# EasyEDA Pro project 音游小键盘.eprj

# Schematic Schematic1
Board Name: Board1; Create Date: 2024-05-16; Page Name: P1; Project Name: KeyBoard; Schematic Name: Schematic1; Update Date: 2024-06-21
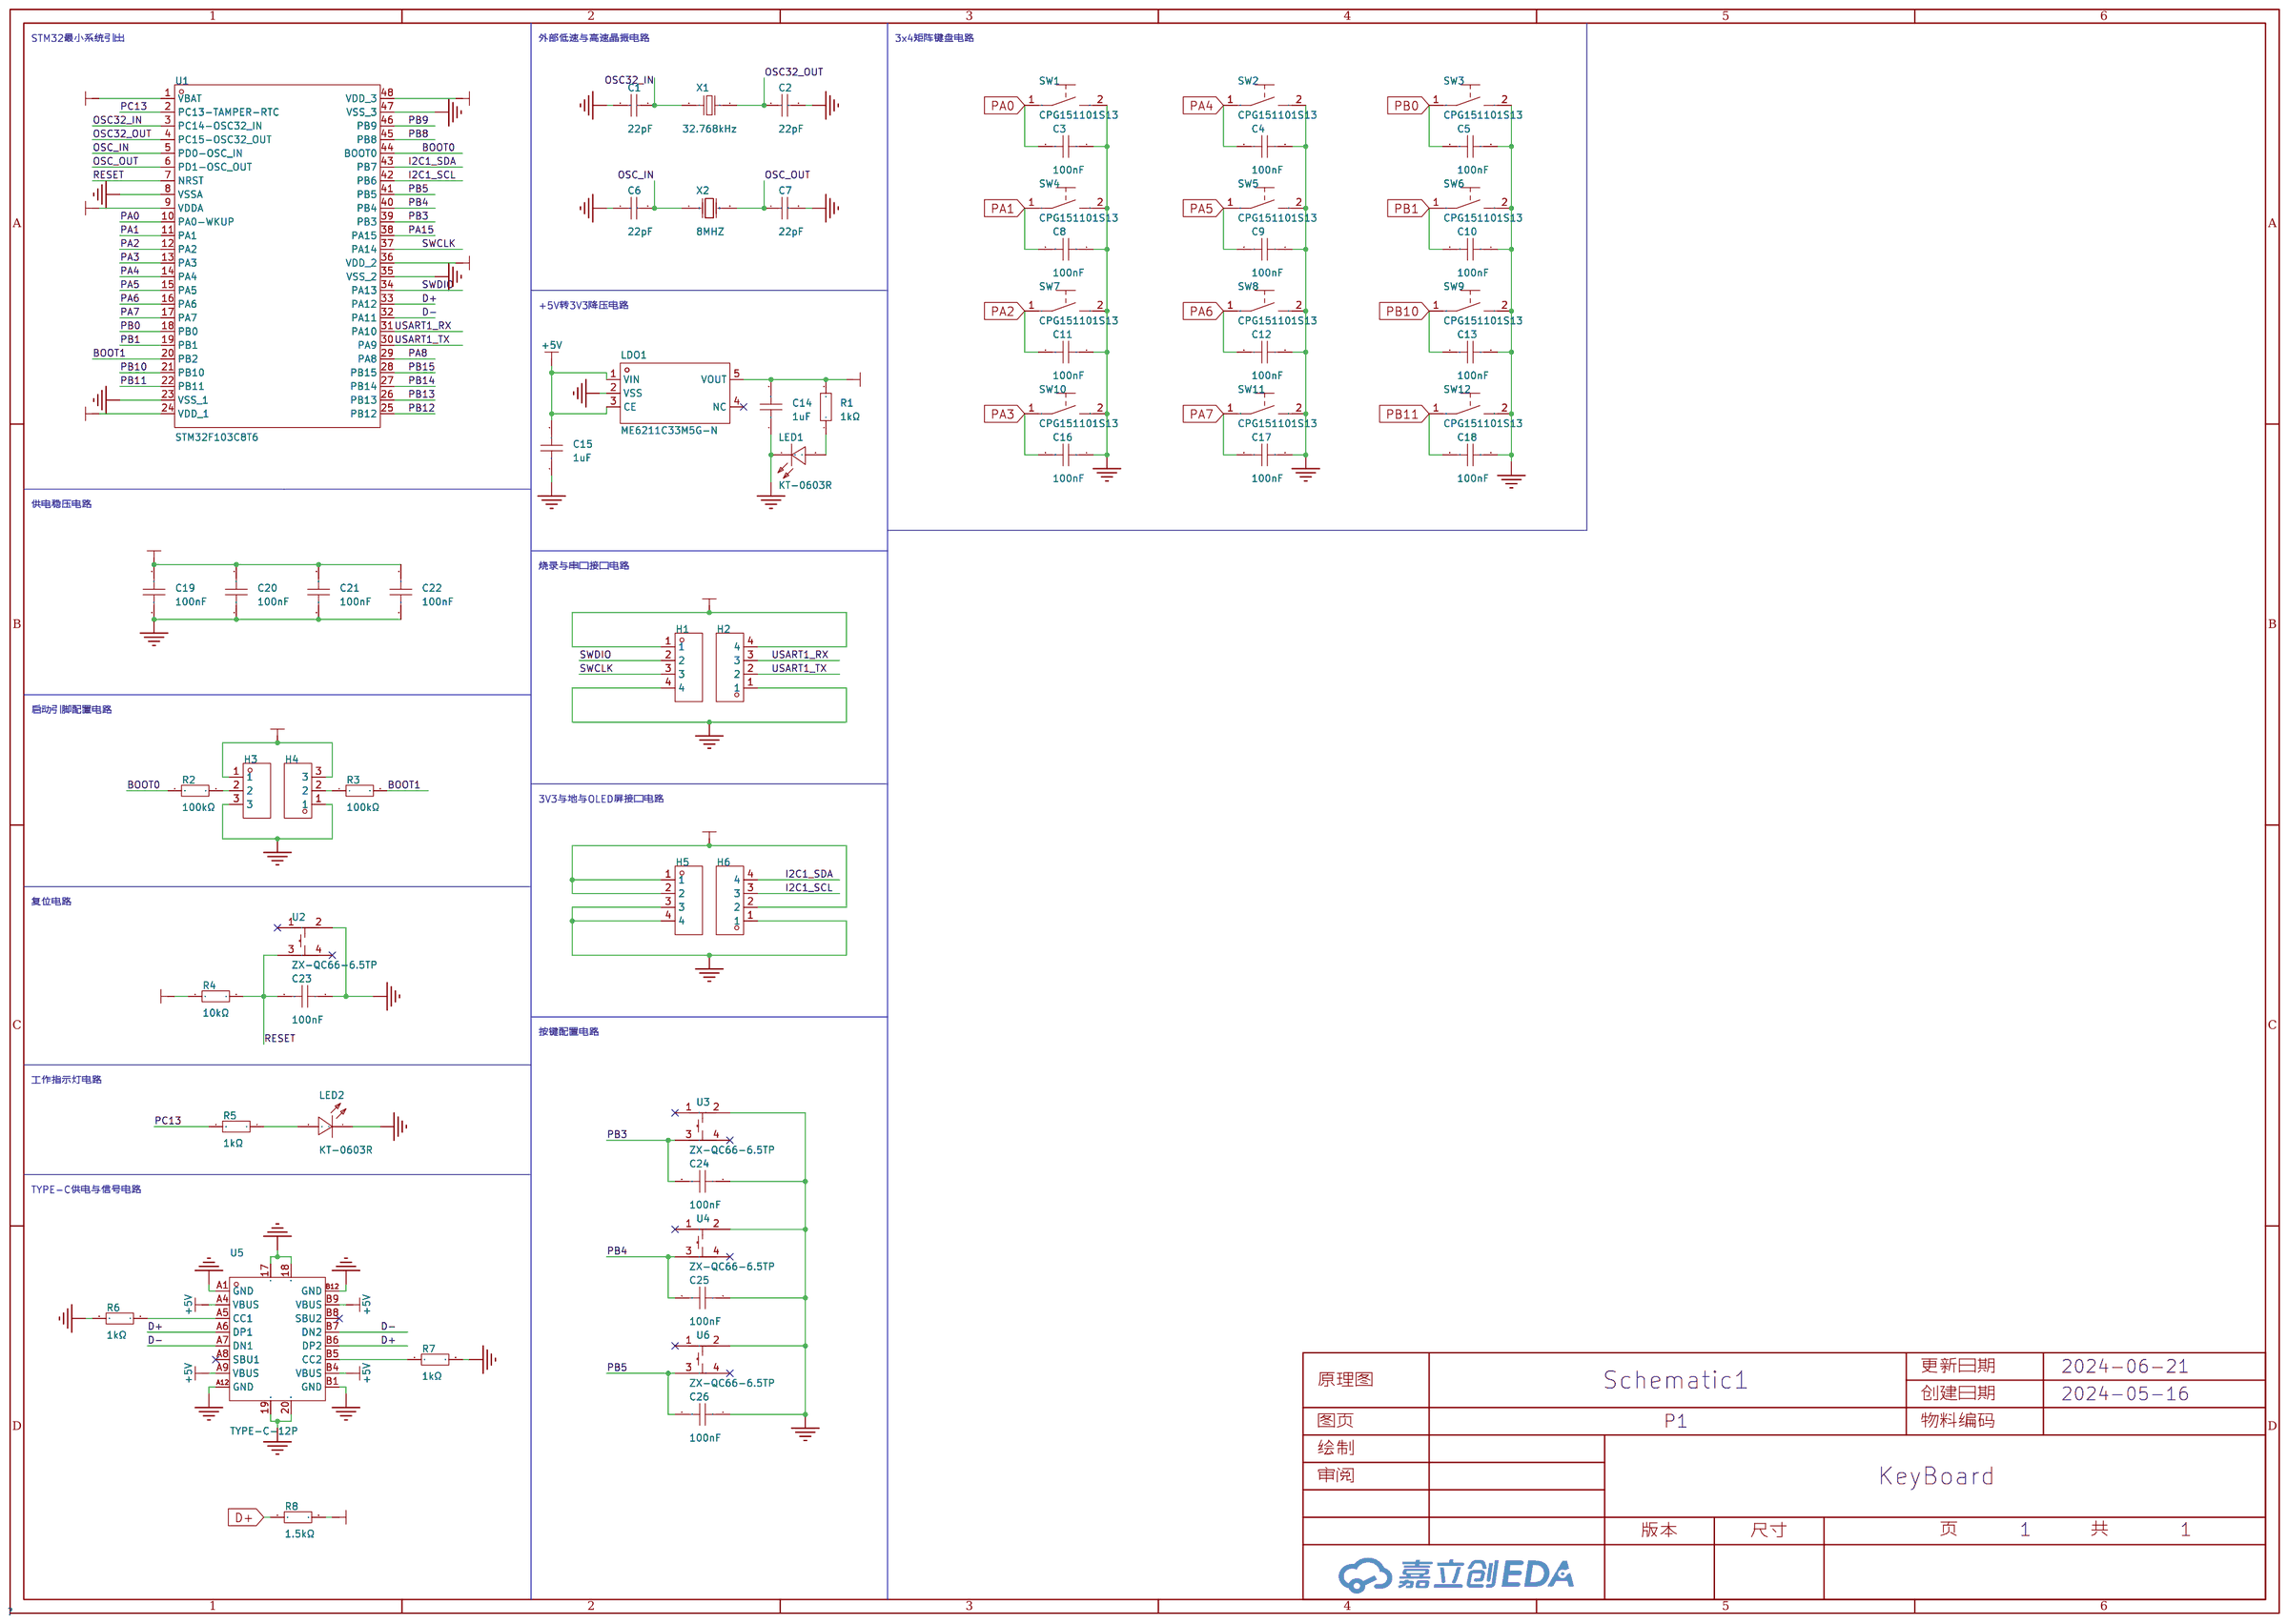
[diagram p0: schematic sheet]

## Parts
C1  22pF  [C0603]
C2  22pF  [C0603]
C3  100nF  [C0603]
C4  100nF  [C0603]
C5  100nF  [C0603]
C6  22pF  [C0603]
C7  22pF  [C0603]
C8  100nF  [C0603]
C9  100nF  [C0603]
C10  100nF  [C0603]
C11  100nF  [C0603]
C12  100nF  [C0603]
C13  100nF  [C0603]
C14  1uF  [C0603]
C15  1uF  [C0603]
C16  100nF  [C0603]
C17  100nF  [C0603]
C18  100nF  [C0603]
C19  100nF  [C0603]
C20  100nF  [C0603]
C21  100nF  [C0603]
C22  100nF  [C0603]
C23  100nF  [C0603]
C24  100nF  [C0603]
C25  100nF  [C0603]
C26  100nF  [C0603]
H1  -  [HDR-TH_4P-P2.54-V-F]
H2  -  [HDR-TH_4P-P2.54-V-F]
H3  -  [HDR-TH_3P-P2.54-V-F]
H4  -  [HDR-TH_3P-P2.54-V-F]
H5  -  [HDR-TH_4P-P2.54-V-F]
H6  -  [HDR-TH_4P-P2.54-V-F]
LDO1  ME6211C33M5G-N  [SOT-23-5_L3.0-W1.7-P0.95-LS2.8-BL]
LED1  KT-0603R  [LED0603-RD]
LED2  KT-0603R  [LED0603-RD]
R1  1kΩ  [R0603]
R2  100kΩ  [R0603]
R3  100kΩ  [R0603]
R4  10kΩ  [R0603]
R5  1kΩ  [R0603]
R6  1kΩ  [R0603]
R7  1kΩ  [R0603]
R8  1.5kΩ  [R0603]
SW1  CPG151101S13  [KEY-TH_CPG1511F01S0X]
SW2  CPG151101S13  [KEY-TH_CPG1511F01S0X]
SW3  CPG151101S13  [KEY-TH_CPG1511F01S0X]
SW4  CPG151101S13  [KEY-TH_CPG1511F01S0X]
SW5  CPG151101S13  [KEY-TH_CPG1511F01S0X]
SW6  CPG151101S13  [KEY-TH_CPG1511F01S0X]
SW7  CPG151101S13  [KEY-TH_CPG1511F01S0X]
SW8  CPG151101S13  [KEY-TH_CPG1511F01S0X]
SW9  CPG151101S13  [KEY-TH_CPG1511F01S0X]
SW10  CPG151101S13  [KEY-TH_CPG1511F01S0X]
SW11  CPG151101S13  [KEY-TH_CPG1511F01S0X]
SW12  CPG151101S13  [KEY-TH_CPG1511F01S0X]
U1  STM32F103C8T6  [LQFP-48_L7.0-W7.0-P0.50-LS9.0-BL]
U2  ZX-QC66-6.5TP  [KEY-SMD_4P-L6.0-W6.0-P4.50-LS8.6]
U3  ZX-QC66-6.5TP  [KEY-SMD_4P-L6.0-W6.0-P4.50-LS8.6]
U4  ZX-QC66-6.5TP  [KEY-SMD_4P-L6.0-W6.0-P4.50-LS8.6]
U5  TYPE-C-12P  [USB-SMD_TYPE-C16PIN]
U6  ZX-QC66-6.5TP  [KEY-SMD_4P-L6.0-W6.0-P4.50-LS8.6]
X1  32.768kHz  [CRYSTAL-SMD_L3.2-W1.5-1]
X2  8MHZ  [HC-49S_L11.5-W5.0-P4.88]

## Library data of the parts
C1 C2 C6 C7 = CL10C220JB8NNNC: 容值:22pF;精度:±5%;额定电压:50V;材质(温度系数):C0G;; LCSC Part Name: 22pF ±5% 50V; Supplier Part: C1653; Manufacturer: SAMSUNG(三星); Supplier Footprint: 0603; JLCPCB Part Class: 基础库; Datasheet: https://atta.szlcsc.com/upload/public/pdf/source/20160218/1457707763339.pdf; Supplier: LCSC; Tolerance: ±5%; Voltage Rated: 50V; Temperature Coefficient: C0G
C3-C5 C8-C13 C16-C26 = CC0603KRX7R9BB104: 容值:100nF;精度:±10%;额定电压:50V;材质(温度系数):X7R;; LCSC Part Name: 100nF ±10% 50V; Supplier Part: C14663; Manufacturer: YAGEO(国巨); Supplier Footprint: 0603; JLCPCB Part Class: 基础库; Datasheet: https://atta.szlcsc.com/upload/public/pdf/source/20180910/C282072_33301C7F631E79921B82A8DAC6BCC5B3.pdf; Supplier: LCSC; Tolerance: ±10%; Voltage Rated: 50V; Temperature Coefficient: X7R
C14 C15 = CL10A105KB8NNNC: 容值:1uF;精度:±10%;额定电压:50V;材质(温度系数):X5R;; LCSC Part Name: 1uF ±10% 50V; Supplier Part: C15849; Manufacturer: SAMSUNG(三星); Supplier Footprint: 0603; JLCPCB Part Class: 基础库; Datasheet: https://atta.szlcsc.com/upload/public/pdf/source/20160218/1457707763339.pdf; Supplier: LCSC; Tolerance: ±10%; Voltage Rated: 50V; Temperature Coefficient: X5R
H1 H2 H5 H6 = HDR-F_2.54_1x4P: Supplier Part: C2718488; Supplier Footprint: 插件; JLCPCB Part Class: 扩展库
H3 H4 = HDR-F_2.54_1x3P: Supplier Part: C541850; Supplier Footprint: 插件; JLCPCB Part Class: 扩展库
LDO1 = ME6211C33M5G-N: 输出类型:固定;最大输入电压:6V;输出电压:3.3V;最大输出电流:500mA;电源纹波抑制比(PSRR):70dB;输出极性:正极;; LCSC Part Name: 输入6V 输出3.3V 500mA; Supplier Part: C82942; Manufacturer: MICRONE(南京微盟); Supplier Footprint: SOT-23-5; JLCPCB Part Class: 扩展库; Datasheet: https://atta.szlcsc.com/upload/public/pdf/source/20170918/C82942_1505727073070976520.pdf; Supplier: LCSC; Output Type: 固定; Maximum Input Voltage: 6V; Output Voltage: 3.3V; MAX Output Current: 500mA; Power Supply Rejection Ratio (PSRR): 70dB; Dropout Voltage: 260mV@(200mA); Output Polarity: 正极; Number of Outputs: 1
LED1 LED2 = KT-0603R: 发光颜色:红色;功率:-;正向电流:-;主波长:-;二极管配置:-;透镜颜色:-;色温:-;发光角度:-;载带方式:-;工作温度:-40℃~+85℃;; LCSC Part Name: 0603 红灯 高亮; Supplier Part: C2286; Manufacturer: KENTO; Supplier Footprint: 0603; JLCPCB Part Class: 基础库; Datasheet: https://atta.szlcsc.com/upload/public/pdf/source/20160616/1466072038404.pdf; Supplier: LCSC; Emitted Color: 红色; Operating Temperature: -40℃~+85℃
R1 R5 = 0603WAF1001T5E: 电阻类型:厚膜电阻;阻值:1kΩ;精度:±1%;功率:100mW;最大工作电压:75V;温度系数:±100ppm/℃;; LCSC Part Name: 1kΩ ±1% 100mW 厚膜电阻; Supplier Part: C21190; Manufacturer: UNI-ROYAL(厚声); Supplier Footprint: 0603; JLCPCB Part Class: 基础库; Datasheet: https://atta.szlcsc.com/upload/public/pdf/source/20200306/C422600_1E6D84923E4A46A82E41ADD87F860B5C.pdf; Supplier: LCSC; Type: 厚膜电阻; Tolerance: ±1%; Power(Watts): 100mW; Overload Voltage (Max): 75V; Temperature Coefficient: ±100ppm/℃; Operating Temperature Range: -55℃~+155℃
R2 R3 = 0603WAF1003T5E: 电阻类型:厚膜电阻;阻值:100kΩ;精度:±1%;功率:100mW;最大工作电压:75V;温度系数:±100ppm/℃;; LCSC Part Name: 100kΩ ±1% 100mW 厚膜电阻; Supplier Part: C25803; Manufacturer: UNI-ROYAL(厚声); Supplier Footprint: 0603; JLCPCB Part Class: 基础库; Datasheet: https://atta.szlcsc.com/upload/public/pdf/source/20200306/C422600_1E6D84923E4A46A82E41ADD87F860B5C.pdf; Supplier: LCSC; Type: 厚膜电阻; Tolerance: ±1%; Power(Watts): 100mW; Overload Voltage (Max): 75V; Temperature Coefficient: ±100ppm/℃; Operating Temperature Range: -55℃~+155℃
R4 R6 R7 = 0603WAF1002T5E: 电阻类型:厚膜电阻;阻值:10kΩ;精度:±1%;功率:100mW;最大工作电压:75V;温度系数:±100ppm/℃;; LCSC Part Name: 厚膜电阻 10kΩ ±1% 100mW; Supplier Part: C25804; Manufacturer: UNI-ROYAL(厚声); Supplier Footprint: 0603; JLCPCB Part Class: 基础库; Datasheet: https://atta.szlcsc.com/upload/public/pdf/source/20200306/C422600_1E6D84923E4A46A82E41ADD87F860B5C.pdf; Supplier: LCSC; Type: 厚膜电阻; Tolerance: ±1%; Power(Watts): 100mW; Overload Voltage (Max): 75V; Temperature Coefficient: ±100ppm/℃; Operating Temperature Range: -55℃~+155℃
R8 = 0603WAF1501T5E: 电阻类型:厚膜电阻;阻值:1.5kΩ;精度:±1%;功率:100mW;最大工作电压:75V;温度系数:±100ppm/℃;; LCSC Part Name: 1.5kΩ ±1% 100mW 厚膜电阻; Supplier Part: C22843; Manufacturer: UNI-ROYAL(厚声); Supplier Footprint: 0603; JLCPCB Part Class: 基础库; Datasheet: https://atta.szlcsc.com/upload/public/pdf/source/20200306/C422600_1E6D84923E4A46A82E41ADD87F860B5C.pdf; Supplier: LCSC; Type: 厚膜电阻; Tolerance: ±1%; Power(Watts): 100mW; Overload Voltage (Max): 75V; Temperature Coefficient: ±100ppm/℃; Operating Temperature Range: -55℃~+155℃
SW1-SW12 = CPG151101S13: 轴类型:青轴;工作电压:2V~12V;针脚数:2;操作力:50gf@±10gf;; LCSC Part Name: KT 青轴; Supplier Part: C404353; Manufacturer: Kailh(凯华); Supplier Footprint: 插件; JLCPCB Part Class: 扩展库; Datasheet: https://atta.szlcsc.com/upload/public/pdf/source/20190830/C404353_03D773C25064FB6981E6251E455188E4.pdf; Supplier: LCSC; Axis Type: 青轴; Operating Voltage: 2V~12V; Pin: 2; Mechanical Life: 7000万次; Operation Force: 50gf@±10gf; Conduction Travel: 1.9mm; Total Travel: 4mm; Operating Temperature: -10℃~+70℃
U1 = STM32F103C8T6: CPU内核:ARM-M3;程序存储容量:64KB;RAM总容量:20KB;GPIO端口数量:37;工作电压范围:2V~3.6V;CPU最大主频:72MHz;程序存储器类型:FLASH;; Supplier Part: C8734; Manufacturer: ST(意法半导体); Supplier Footprint: LQFP-48(7x7); JLCPCB Part Class: 扩展库; Datasheet: https://atta.szlcsc.com/upload/public/pdf/source/20220812/8363ACEC51AD55ECEB84799464F7CB85.pdf; Supplier: LCSC; CPU Core: ARM-M3; Program Storage Size: 64KB; RAM Size: 20KB; GPIO Ports Number: 37; Operating Voltage Range: 2V~3.6V; CPU Maximum Speed: 72MHz; Program Memory Type: FLASH; Operating Temperature Range: -40℃~+85℃; ADC (Bit): 12bit; Universal Serial Bus: 有; Peripheral/Function: 看门狗；DMA；看门狗；温度传感器; Watchdog: 有; Infrared Data Association: 有; Low-Voltage Detect: 有; Direct Memory Access: 有; Internal Oscillator: 有
U2-U4 U6 = ZX-QC66-6.5TP: 电路结构:单刀单掷;按钮形状:圆形按钮;作用力:260gf;安装方式:立贴;开关长度:6mm;开关宽度:6mm;开关高度:6.5mm;带支架:不带;触点电流:50mA;额定电压(AC):250V;额定电压(DC):12V;绝缘电阻:100MΩ;机械寿命:10万次;; LCSC Part Name: 6*6*6.5贴片; Supplier Part: C7470155; Manufacturer: Megastar(兆星); Supplier Footprint: SMD; JLCPCB Part Class: 扩展库; Datasheet: https://atta.szlcsc.com/upload/public/pdf/source/20230724/B428FC16196F325371E46D1CDDE28AA5.pdf; Supplier: LCSC; Circuit: 单刀单掷; Actuator Style: 圆形按钮; Operating Force: 260gf; Mounting Style: 立贴; Switch Length: 6mm; Switch Width: 6mm; Switch Height: 6.5mm; Strike Gundam: 不带; Contact Current: 50mA; Voltage Rating (AC): 250V; Voltage Rating (DC): 12V; Insulation Resistance: 100MΩ; Actuator/Cap Color: 黑色; Pin Style: 鸥翼型; Mechanical Life: 10万次; Operating Temperature: -30℃~+80℃
U5 = TYPE-C-12P: Supplier Part: C9900014866; Supplier Footprint: USB_TypeC; JLCPCB Part Class: 扩展库; Supplier: LCSC
X1 = FC31M2-32.768-NTLLLDT: 晶振类型:贴片晶振;频率:32.768kHz;常温频差:±20ppm;外接负载电容:12.5pF;频率稳定度(全温):±20ppm;; LCSC Part Name: 32.768kHz ±20ppm 12.5pF; Supplier Part: C2842180; Manufacturer: HCI(杭晶); Supplier Footprint: SMD3215-2P; JLCPCB Part Class: 扩展库; Datasheet: https://atta.szlcsc.com/upload/public/pdf/source/20220525/2E044CF849361D91E29045F083201687.pdf; Supplier: LCSC; Crystal Type: 贴片晶振; Normal temperature Frequency Tolerance: ±20ppm; External load capacitor: 12.5pF; Frequency Stability(Full temperature range): ±20ppm; Equivalent Series Resistance (ESR): 50kΩ; Operating Temperature: -40℃~+85℃
X2 = 8MHZ: Supplier Part: C9900021358; Supplier Footprint: X-HC49U直插; JLCPCB Part Class: 扩展库; Supplier: LCSC

## Nets
3V3: C14.2 C19.2 C20.2 C21.2 C22.2 H1.1 H2.4 H3.1 H4.3 H5.1 H5.2 H6.2 LDO1.5(VOUT) R1.2 R4.2 R8.2 U1.1(VBAT) U1.9(VDDA) U1.24(VDD_1) U1.36(VDD_2) U1.48(VDD_3)
+5V: C15.2 LDO1.1(VIN) LDO1.3(CE) U5.A4(VBUS) U5.A9(VBUS) U5.B4(VBUS) U5.B9(VBUS)
GND: C1.1 C2.1 C3.1 C4.1 C5.1 C6.1 C7.2 C8.1 C9.1 C10.1 C11.1 C12.1 C13.1 C14.1 C15.1 C16.1 C17.1 C18.1 C19.1 C20.1 C21.1 C22.1 C23.1 C24.1 C25.1 C26.1 H1.4 H2.1 H3.3 H4.1 H5.3 H5.4 H6.1 LDO1.2(VSS) LED1.1(K) LED2.1(K) R6.2 R7.2 SW1.2 SW2.2 SW3.2 SW4.2 SW5.2 SW6.2 SW7.2 SW8.2 SW9.2 SW10.2 SW11.2 SW12.2 U1.8(VSSA) U1.23(VSS_1) U1.35(VSS_2) U1.47(VSS_3) U2.2 U3.2 U4.2 U5.17 U5.18 U5.19 U5.20 U5.A1(GND) U5.A12(GND) U5.B1(GND) U5.B12(GND) U6.2
BOOT0: R2.1 U1.44(BOOT0)
BOOT1: R3.2 U1.20(PB2)
D+: R8.1 U1.33(PA12) U5.A6(DP1) U5.B6(DP2)
D-: U1.32(PA11) U5.A7(DN1) U5.B7(DN2)
I2C1_SCL: H6.3 U1.42(PB6)
I2C1_SDA: H6.4 U1.43(PB7)
OSC32_IN: C1.2 U1.3(PC14-OSC32_IN) X1.2
OSC32_OUT: C2.2 U1.4(PC15-OSC32_OUT) X1.1
OSC_IN: C6.2 U1.5(PD0-OSC_IN) X2.1(OSC1)
OSC_OUT: C7.1 U1.6(PD1-OSC_OUT) X2.2(OSC2)
PA0: C3.2 SW1.1 U1.10(PA0-WKUP)
PA1: C8.2 SW4.1 U1.11(PA1)
PA2: C11.2 SW7.1 U1.12(PA2)
PA3: C16.2 SW10.1 U1.13(PA3)
PA4: C4.2 SW2.1 U1.14(PA4)
PA5: C9.2 SW5.1 U1.15(PA5)
PA6: C12.2 SW8.1 U1.16(PA6)
PA7: C17.2 SW11.1 U1.17(PA7)
PA8: U1.29(PA8)
PA15: U1.38(PA15)
PB0: C5.2 SW3.1 U1.18(PB0)
PB1: C10.2 SW6.1 U1.19(PB1)
PB3: C24.2 U1.39(PB3) U3.3
PB4: C25.2 U1.40(PB4) U4.3
PB5: C26.2 U1.41(PB5) U6.3
PB8: U1.45(PB8)
PB9: U1.46(PB9)
PB10: C13.2 SW9.1 U1.21(PB10)
PB11: C18.2 SW12.1 U1.22(PB11)
PB12: U1.25(PB12)
PB13: U1.26(PB13)
PB14: U1.27(PB14)
PB15: U1.28(PB15)
PC13: R5.2 U1.2(PC13-TAMPER-RTC)
RESET: C23.2 R4.1 U1.7(NRST) U2.3
SWCLK: H1.3 U1.37(PA14)
SWDIO: H1.2 U1.34(PA13)
USART1_RX: H2.3 U1.31(PA10)
USART1_TX: H2.2 U1.30(PA9)
$1N2502: LED2.2(A) R5.1
$1N8138: H3.2 R2.2
$1N8141: H4.2 R3.1
$1N12765: LED1.2(A) R1.1
$1N28341: R6.1 U5.A5(CC1)
$1N28394: R7.1 U5.B5(CC2)

Not connected (* = marked no-connect by the designer): LDO1 4(NC)*; U2 1* 4*; U3 1* 4*; U4 1* 4*; U5 A8(SBU1)* B8(SBU2)*; U6 1* 4*

## Notes on the sheet
- STM32最小系统引出
- 外部低速与高速晶振电路
- 3x4矩阵键盘电路
- +5V转3V3降压电路
- 供电稳压电路
- 烧录与串口接口电路
- 启动引脚配置电路
- 3V3与地与OLED屏接口电路
- 复位电路
- 按键配置电路
- 工作指示灯电路
- TYPE-C供电与信号电路

# Board PCB1
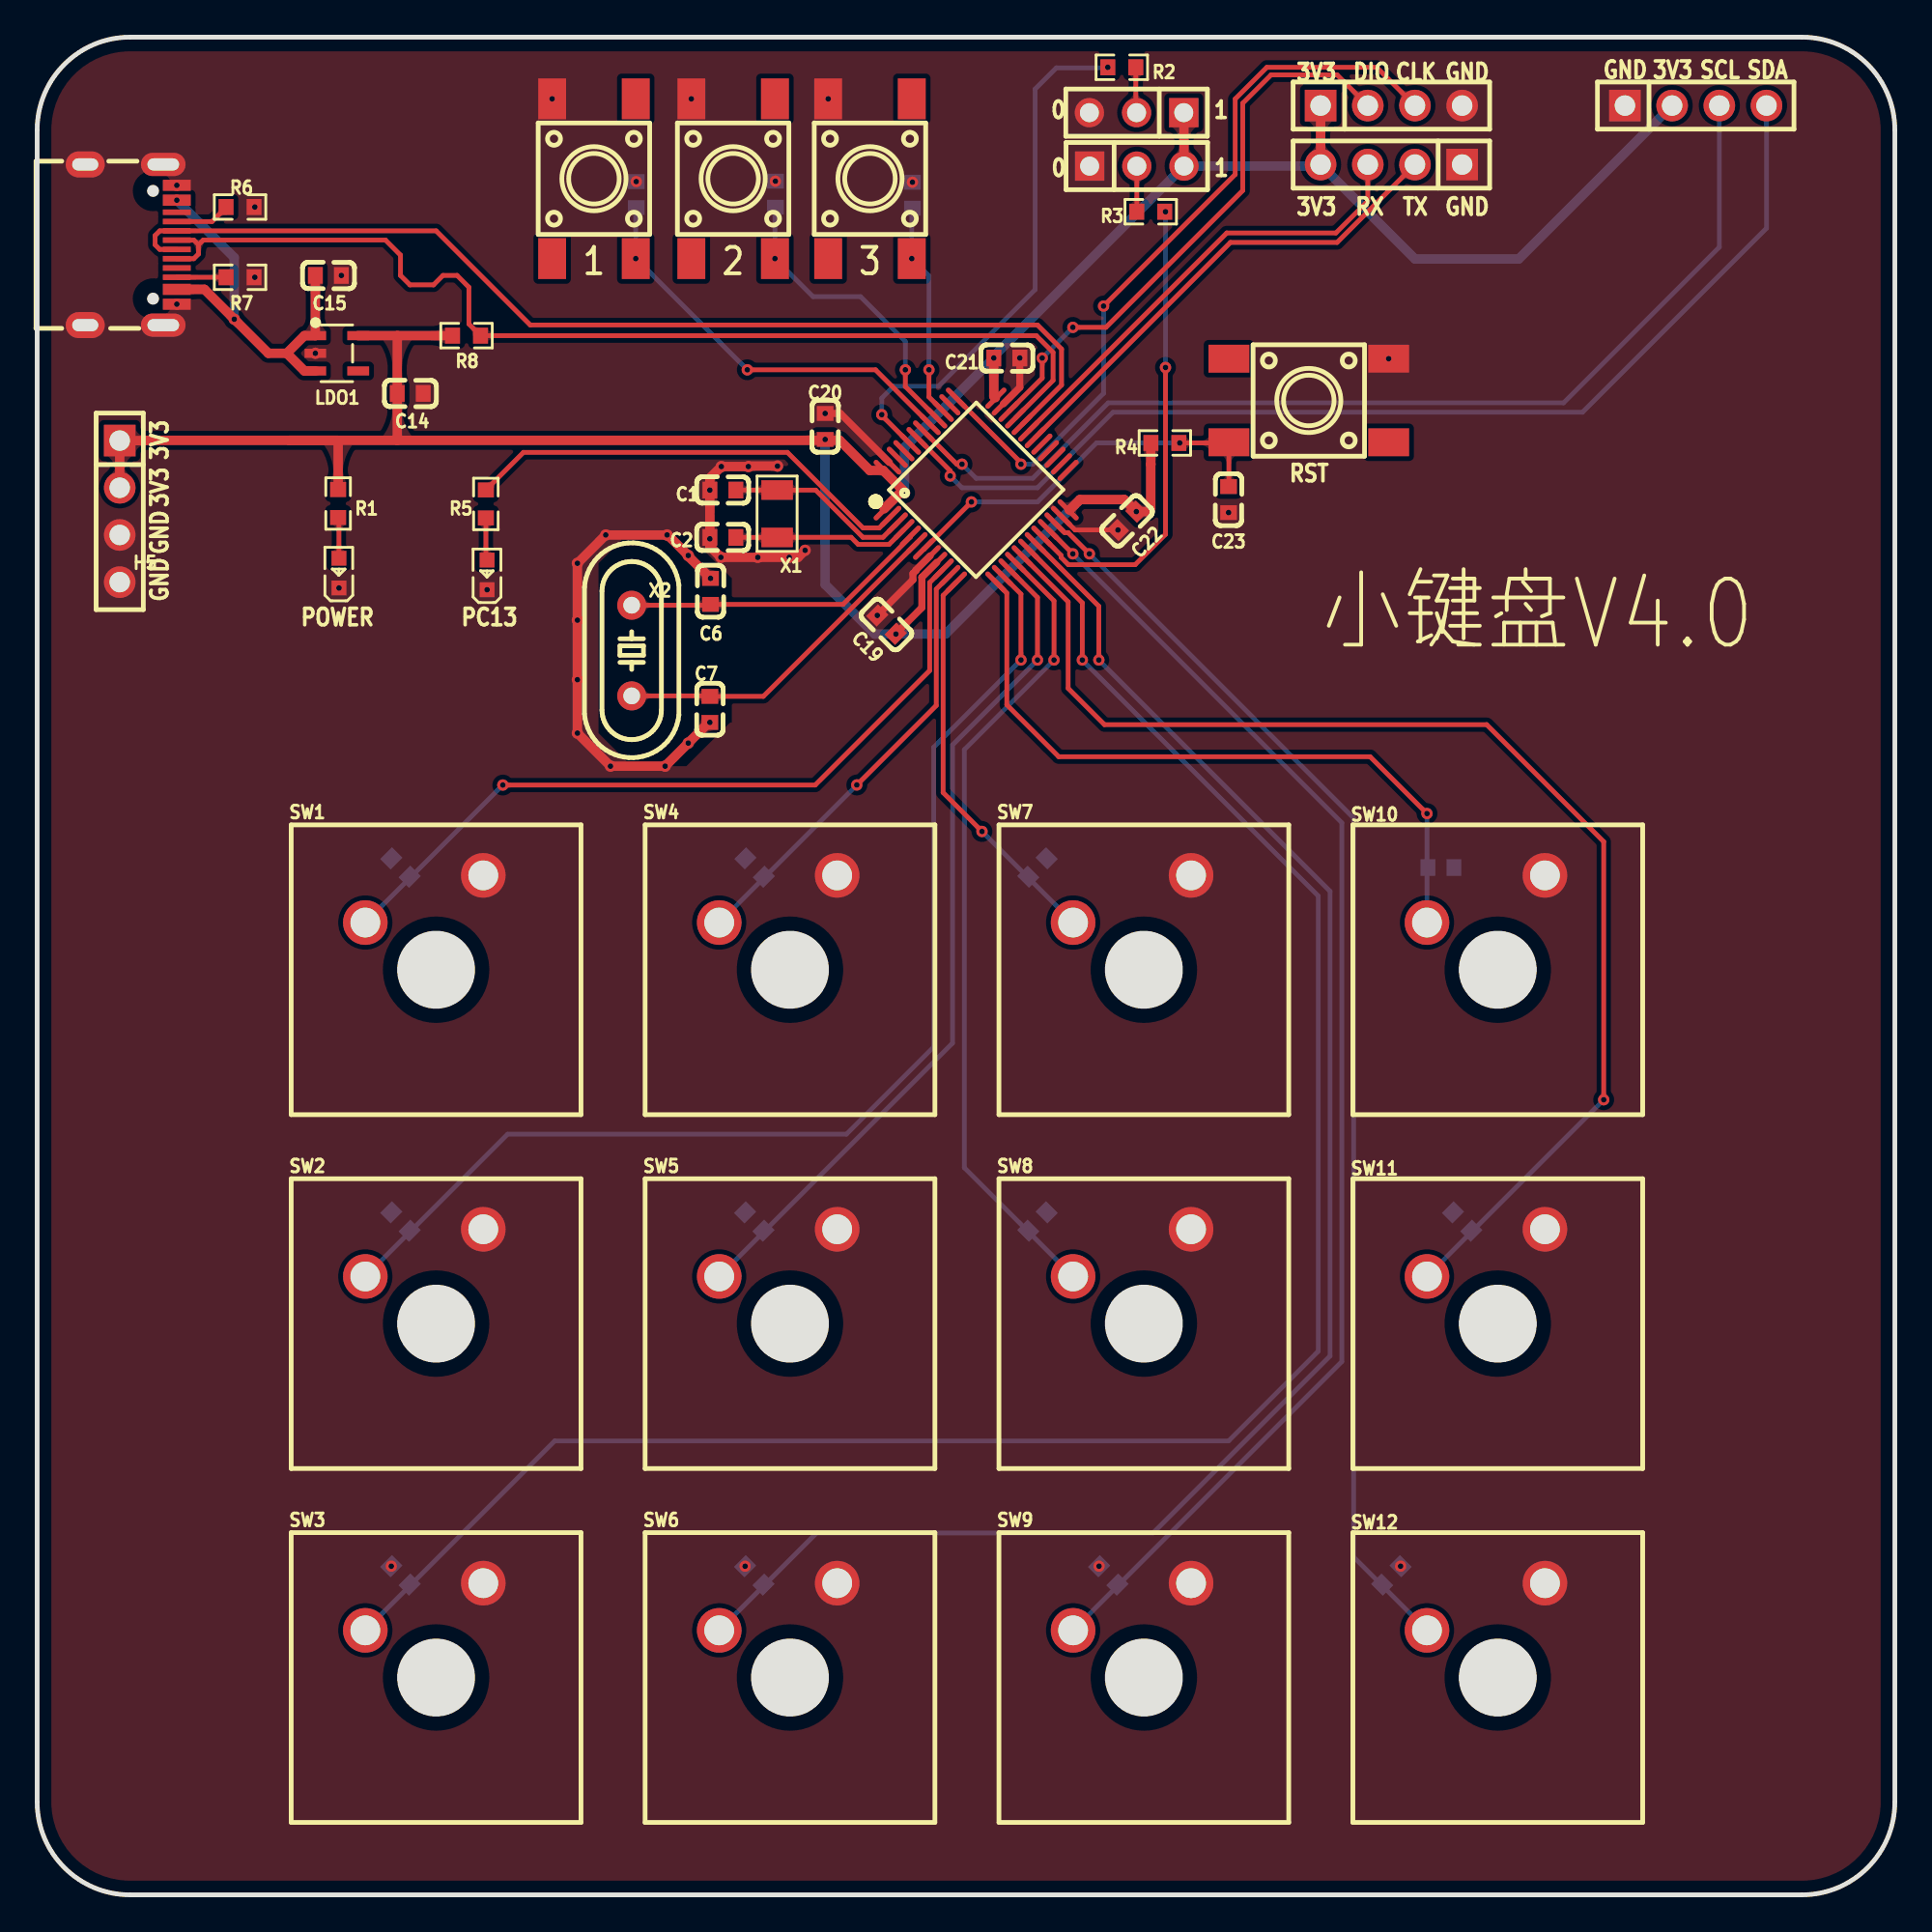
[diagram p1: board, top side]
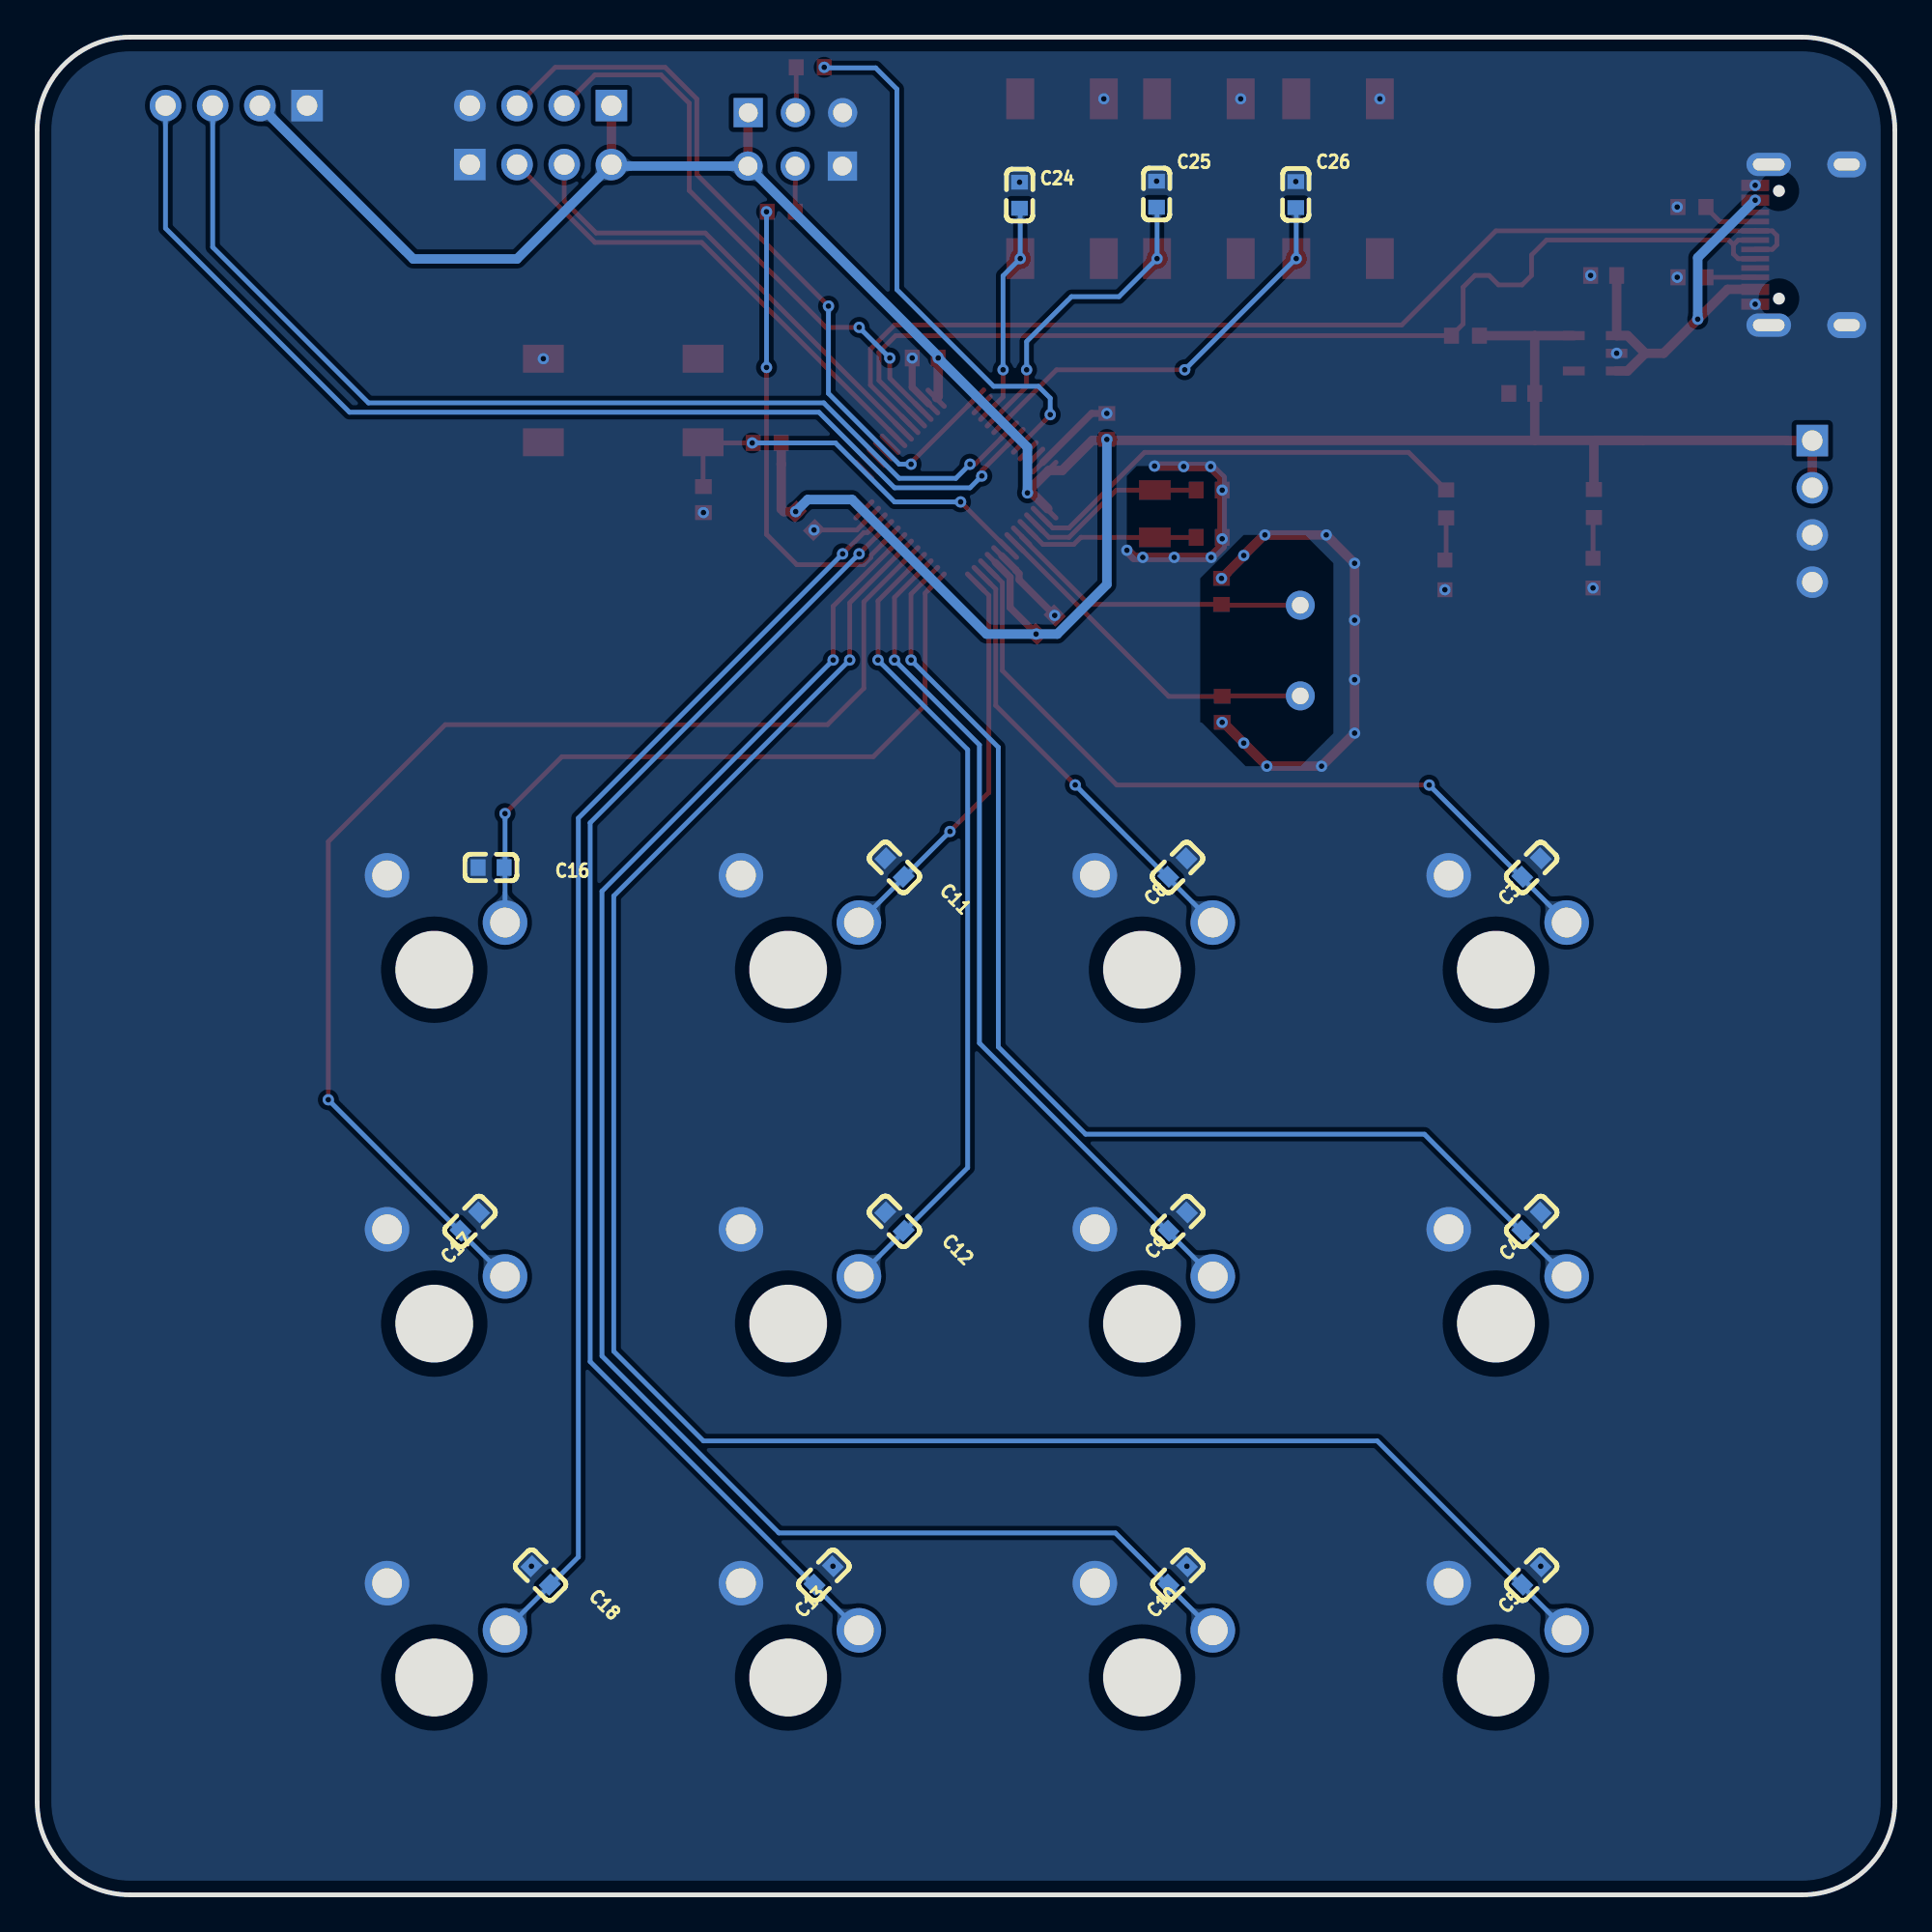
[diagram p2: board, bottom side, seen from below]

Outline 100 x 100 mm; copper layers: Top Layer, Bottom Layer. Coordinates in mm from the lower left corner of the outline.
Outline path: 0,95 0,5 arc(1.46,1.46) 5,0 95,0 arc(98.54,1.46) 100,5 100,95 arc(98.54,98.54) 95,100 5,100 arc(1.46,98.54) 0,95
Stack: Top Layer 0.035mm / Dielectric1 1.51mm FR4 er 4.5 / Bottom Layer 0.035mm

## Design rules (mm)
net D-: DP1
net D+: DP1
template: 自定义配置
spacing copperThickness1oz (default): track to track 0.102, other pairs 0.152 to 0.3
spacing copperThickness2oz: track to track 0.203, other pairs 0.152 to 0.3
track width copperThickness1oz (default): min 0.127, default 0.254, max 2.54
track width copperThickness2oz: min 0.203, default 0.254, max 2.54
track width Power: min 0.127, default 0.508, max 2.54
differential pair differentialPair (default): width min 0.127, default 0.254, max 2.54; gap min 0.152, default 0.152
via viaSize (default): diameter min 0.5, default 0.61, max 10; hole min 0.3, default 0.305, max 6.299
net GND uses Power
net 3V3 uses Power
net +5V uses Power

## Placement (name value [footprint] x y rotation side)
C1  22pF  [C0603]  36.91 75.62 0 top
C2  22pF  [C0603]  36.91 73.07 0 top
C3  100nF  [C0603]  19.56 55.3 315 bottom
C4  100nF  [C0603]  19.56 36.25 315 bottom
C5  100nF  [C0603]  19.56 17.2 315 bottom
C6  22pF  [C0603]  36.25 70.17 270 top
C7  22pF  [C0603]  36.21 63.81 270 top
C8  100nF  [C0603]  38.62 55.3 315 bottom
C9  100nF  [C0603]  38.6 36.25 315 bottom
C10  100nF  [C0603]  38.6 17.2 315 bottom
C11  100nF  [C0603]  53.85 55.3 225 bottom
C12  100nF  [C0603]  53.85 36.25 225 bottom
C13  100nF  [C0603]  57.66 17.2 315 bottom
C14  1uF  [C0603]  20.08 80.82 180 top
C15  1uF  [C0603]  15.68 87.17 180 top
C16  100nF  [C0603]  75.56 55.3 180 bottom
C17  100nF  [C0603]  76.71 36.25 315 bottom
C18  100nF  [C0603]  72.9 17.2 225 bottom
C19  100nF  [C0603]  45.72 68.38 315 top
C20  100nF  [C0603]  42.42 79.05 270 top
C21  100nF  [C0603]  52.2 82.73 180 top
C22  100nF  [C0603]  58.67 73.97 45 top
C23  100nF  [C0603]  64.13 75.11 90 top
C24  100nF  [C0603]  47.12 91.49 270 bottom
C25  100nF  [C0603]  39.74 91.55 270 bottom
C26  100nF  [C0603]  32.25 91.53 270 bottom
H1  -  [HDR-TH_4P-P2.54-V-F]  72.9 96.32 0 top
H2  -  [HDR-TH_4P-P2.54-V-F]  72.9 93.14 180 top
H3  -  [HDR-TH_3P-P2.54-V-F]  59.18 95.94 180 top
H4  -  [HDR-TH_3P-P2.54-V-F]  59.19 93.06 0 top
H5  -  [HDR-TH_4P-P2.54-V-F]  4.44 74.47 270 top
H6  -  [HDR-TH_4P-P2.54-V-F]  89.28 96.32 0 top
LDO1  ME6211C33M5G-N  [SOT-23-5_L3.0-W1.7-P0.95-LS2.8-BL]  16.13 82.98 270 top
LED1  KT-0603R  [LED0603-RD]  16.24 71.15 90 top
LED2  KT-0603R  [LED0603-RD]  24.22 71.05 90 top
R1  1kΩ  [R0603]  16.2 74.89 90 top
R2  100kΩ  [R0603]  58.39 98.38 0 top
R3  100kΩ  [R0603]  59.94 90.6 0 top
R4  10kΩ  [R0603]  60.71 78.16 180 top
R5  1kΩ  [R0603]  24.15 74.87 90 top
R6  1kΩ  [R0603]  10.92 90.86 0 top
R7  1kΩ  [R0603]  10.92 87.07 0 top
R8  1.5kΩ  [R0603]  23.11 83.93 180 top
SW1  CPG151101S13  [KEY-TH_CPG1511F01S0X]  20.84 53.61 0 top
SW2  CPG151101S13  [KEY-TH_CPG1511F01S0X]  20.84 34.56 0 top
SW3  CPG151101S13  [KEY-TH_CPG1511F01S0X]  20.84 15.51 0 top
SW4  CPG151101S13  [KEY-TH_CPG1511F01S0X]  39.89 53.61 0 top
SW5  CPG151101S13  [KEY-TH_CPG1511F01S0X]  39.89 34.56 0 top
SW6  CPG151101S13  [KEY-TH_CPG1511F01S0X]  39.89 15.51 0 top
SW7  CPG151101S13  [KEY-TH_CPG1511F01S0X]  58.94 53.61 0 top
SW8  CPG151101S13  [KEY-TH_CPG1511F01S0X]  58.94 34.56 0 top
SW9  CPG151101S13  [KEY-TH_CPG1511F01S0X]  58.94 15.51 0 top
SW10  CPG151101S13  [KEY-TH_CPG1511F01S0X]  77.99 53.61 0 top
SW11  CPG151101S13  [KEY-TH_CPG1511F01S0X]  77.99 34.56 0 top
SW12  CPG151101S13  [KEY-TH_CPG1511F01S0X]  77.99 15.51 0 top
U1  STM32F103C8T6  [LQFP-48_L7.0-W7.0-P0.50-LS9.0-BL]  50.55 75.62 315 top
U2  ZX-QC66-6.5TP  [KEY-SMD_4P-L6.0-W6.0-P4.50-LS8.6]  68.45 80.44 0 top
U3  ZX-QC66-6.5TP  [KEY-SMD_4P-L6.0-W6.0-P4.50-LS8.6]  44.83 92.38 90 top
U4  ZX-QC66-6.5TP  [KEY-SMD_4P-L6.0-W6.0-P4.50-LS8.6]  37.47 92.38 90 top
U5  TYPE-C-12P  [USB-SMD_TYPE-C16PIN]  4.95 88.82 270 top
U6  ZX-QC66-6.5TP  [KEY-SMD_4P-L6.0-W6.0-P4.50-LS8.6]  29.97 92.38 90 top
X1  32.768kHz  [CRYSTAL-SMD_L3.2-W1.5-1]  39.83 74.35 90 top
X2  8MHZ  [HC-49S_L11.5-W5.0-P4.88]  32 66.98 270 top

## Footprints (pads in the part's own frame, mm; a bottom-side part is the same pattern mirrored in y, then rotated)
C0603
  rect 0.8x0.9 smd: 1(-0.7,0) 2(0.7,0)
CRYSTAL-SMD_L3.2-W1.5-1
  rect 1.05x1.7 smd: 1(-1.275,0) 2(1.275,0)
HC-49S_L11.5-W5.0-P4.88
  round 1.56 hole 0.9: 1(-2.44,0) 2(2.44,0)
HDR-TH_3P-P2.54-V-F
  rect 1.575x1.575 hole 1.02: 1(-2.54,0)
  round 1.575 hole 1.02: 2(0,0) 3(2.54,0)
HDR-TH_4P-P2.54-V-F
  rect 1.7x1.7 hole 1.1: 1(-3.81,0)
  round 1.7 hole 1.1: 2(-1.27,0) 3(1.27,0) 4(3.81,0)
KEY-SMD_4P-L6.0-W6.0-P4.50-LS8.6
  rect 2.2x1.5 smd: 1(-4.3,2.25) 2(4.3,2.25) 3(-4.3,-2.25) 4(4.3,-2.25)
KEY-TH_CPG1511F01S0X
  round 2.4 hole 1.6: 1(-3.175,-1.27) 2(3.175,1.27)
LED0603-RD
  rect 0.8x0.8 smd: 1(-0.799,0) 2(0.799,0)
LQFP-48_L7.0-W7.0-P0.50-LS9.0-BL
  oval 0.27x1.5 smd: 1(-2.75,-4.25) 2(-2.25,-4.25) 3(-1.75,-4.25) 4(-1.25,-4.25) 5(-0.75,-4.25) 6(-0.25,-4.25) 7(0.25,-4.25) 8(0.75,-4.25) 9(1.25,-4.25) 10(1.75,-4.25) 11(2.25,-4.25) 12(2.75,-4.25) 25(2.75,4.25) 26(2.25,4.25) 27(1.75,4.25) 28(1.25,4.25) 29(0.75,4.25) 30(0.25,4.25) 31(-0.25,4.25) 32(-0.75,4.25) 33(-1.25,4.25) 34(-1.75,4.25) 35(-2.25,4.25) 36(-2.75,4.25)
  oval 1.5x0.27 smd: 13(4.25,-2.75) 14(4.25,-2.25) 15(4.25,-1.75) 16(4.25,-1.25) 17(4.25,-0.75) 18(4.25,-0.25) 19(4.25,0.25) 20(4.25,0.75) 21(4.25,1.25) 22(4.25,1.75) 23(4.25,2.25) 24(4.25,2.75) 37(-4.25,2.75) 38(-4.25,2.25) 39(-4.25,1.75) 40(-4.25,1.25) 41(-4.25,0.75) 42(-4.25,0.25) 43(-4.25,-0.25) 44(-4.25,-0.75) 45(-4.25,-1.25) 46(-4.25,-1.75) 47(-4.25,-2.25) 48(-4.25,-2.75)
R0603
  rect 0.806x0.864 smd: 1(-0.753,0) 2(0.753,0)
SOT-23-5_L3.0-W1.7-P0.95-LS2.8-BL
  rect 0.49x1.157 smd: 1(-0.95,-1.153) 2(0,-1.153) 3(0.95,-1.153)
  rect 0.49x1.175 smd: 4(0.95,1.153) 5(-0.95,1.153)
USB-SMD_TYPE-C16PIN
  oval 1.25x2.4 hole 0.65x1.7: 17(-4.325,1.835) 18(4.325,1.835)
  oval 1.4x2.1 hole 0.65x1.4: 19(-4.325,-2.365) 20(4.325,-2.365)
  rect 0.6x1.5 smd: A1(-3.2,2.565) A4(-2.4,2.565) A9(2.4,2.565) A12(3.2,2.565)
  rect 0.3x1.5 smd: A5(-1.25,2.565) A6(-0.25,2.565) A7(0.25,2.565) A8(1.25,2.565) B5(1.75,2.565) B6(0.75,2.565) B7(-0.75,2.565) B8(-1.75,2.565)

## Nets
As in the schematic, except:
+5V: C15.2 LDO1.1 LDO1.3 U5.A4 U5.A9
GND: C1.1 C2.1 C3.1 C4.1 C5.1 C6.1 C7.2 C8.1 C9.1 C10.1 C11.1 C12.1 C13.1 C14.1 C15.1 C16.1 C17.1 C18.1 C19.1 C20.1 C21.1 C22.1 C23.1 C24.1 C25.1 C26.1 H1.4 H2.1 H3.3 H4.1 H5.3 H5.4 H6.1 LDO1.2 LED1.1 LED2.1 R6.2 R7.2 SW1.2 SW2.2 SW3.2 SW4.2 SW5.2 SW6.2 SW7.2 SW8.2 SW9.2 SW10.2 SW11.2 SW12.2 U1.8 U1.23 U1.35 U1.47 U2.2 U3.2 U4.2 U5.17 U5.18 U5.19 U5.20 U5.A1 U5.A12 U6.2

Pads without a net: LDO1 4; U2 1 4; U3 1 4; U4 1 4; U5 A8 B8; U6 1 4

## Via types
v1: diameter 0.61, hole 0.305, Top Layer to Bottom Layer, 82 vias

## Routing (per net, layer and track width the routed paths; a pad name or vN(x,y) marks a point on that pad's centre or on a via; arc(x,y) is an arc through that point)
3V3: length 169.3
  Top Layer w0.381: 46.22,67.88 47.62,69.29 47.62,70.93 48.42,71.73
  Top Layer w0.508: LDO1.5 19.38,83.93 ; 19.38,83.93 R8.2 ; 19.38,83.93 19.38,78.3 ; 55.55,74.56 55.58,74.56 56.13,75.11 58.52,75.11 v1(59.17,74.46) 59.8,74.46 59.94,74.6 59.94,77 ; R1.2 16.2,78.3 13.55,78.3 ; H5.2 H5.1 5.8,78.28 5.82,78.3 13.55,78.3 ; H3.1 61.73,95.92 H4.3 ; 51.58,80.59 51.5,80.68 v1(51.5,82.73) ; 59.94,77 59.95,77.01 ; 59.94,77 59.94,78.15 R4.2 ; 19.38,78.3 13.55,78.3 ; 19.38,78.3 43.2,78.3 44.82,76.68 45.54,76.68 46.6,75.62 45.6,74.61 ; H1.1 H2.4
  Bottom Layer w0.508: v1(42.42,78.34) 42.42,70.54 45.09,67.87 v1(46.23,67.87) 48.9,67.87 56.13,75.11 58.52,75.11 v1(59.17,74.46) ; H6.2 79.76,88.06 74.17,88.06 H2.4 69,93.06 H4.3 51.5,82.82 v1(51.5,82.73) 46.69,77.92 v1(46.69,75.47)
+5V: length 22.1
  Top Layer w0.508: C15.2 LDO1.1 14.39,83.93 13.44,82.98 ; LDO1.3 14.39,82.03 13.44,82.98 ; U5.A9 9,86.42 v1(10.61,84.82) 12.45,82.98 13.44,82.98
  Bottom Layer w0.508: v1(7.52,91.22) 10.61,88.13 v1(10.61,84.82)
GND: length 55
  Top Layer w0.254: v1(58.18,73.47) 55.87,73.47 U1.23
  Top Layer w0.381: v1(42.42,79.75) 43.24,79.75 45.87,77.11 ; U1.8 47.31,71.32 47.31,71.3 47.14,71.13 47.14,70.79 v1(45.22,68.87) ; 52.01,80.26 52.9,81.15 v1(52.9,82.73)
  Top Layer w0.508: v1(36.25,70.87) 35.05,72.06 v1(35.05,72.1) 33.94,73.2 v1(33.91,73.2) v1(30.61,73.2) v1(29.08,71.68) v1(29.08,68.62) v1(29.08,65.41) v1(29.08,62.53) v1(30.86,60.76) v1(33.81,60.76) v1(35.05,62) 36.16,63.11 v1(36.21,63.11) ; v1(39.85,76.91) 38.31,76.91 v1(38.28,76.89) v1(36.83,76.89) 36.21,76.27 v1(36.21,75.62) v1(36.21,73) 36.21,72.59 v1(36.81,72) v1(38.79,72) v1(40.49,72) 40.96,72 v1(41.34,72.38)
  vias: v1(7.52,92.02) v1(7.52,85.62) v1(11.72,90.86) v1(11.72,87.07) v1(14.98,82.98) v1(16.25,70.35) v1(16.38,87.17) v1(19.06,17.69) v1(24.22,70.25) v1(27.72,96.68) v1(32.25,92.23) v1(35.22,96.68) v1(38.11,17.69) v1(39.74,92.25) v1(42.58,96.68) v1(47.12,92.19) v1(57.16,17.69) v1(64.13,74.41) v1(72.75,82.69) v1(73.39,17.69)
BOOT0: length 29
  Top Layer w0.254: 47.01,78.09 45.47,79.64 v1(45.47,79.68)
  Bottom Layer w0.254: v1(57.63,98.38) 57.6,98.35 54.86,98.35 53.72,97.21 53.72,86.41 48.51,81.2 46.1,81.2 45.47,80.57 v1(45.47,79.68)
BOOT1: length 25.4
  Top Layer w0.254: v1(60.74,82.22) 60.74,73.24 59.11,71.6 55.51,71.6 55.12,72 55.12,72.1 54.08,73.14
  Bottom Layer w0.254: v1(60.74,90.6) v1(60.74,82.22)
D+: length 58.2
  Top Layer w0.254: 8.69,88.82 8.94,89.08 18.75,89.08 19.56,88.27 19.56,87.17 20.07,86.67 21.34,86.67 21.84,87.17 22.61,87.17 23.24,86.54 23.24,84.56 R8.1 53.79,83.93 54.69,83.03 54.69,81.52 52.67,79.5 ; 8.69,88.82 8.69,88.33 8.43,88.07 U5.B6 ; 8.69,88.82 8.44,89.07 U5.A6
D-: length 58.2
  Top Layer w0.254: U5.A7 6.6,88.57 6.35,88.82 6.35,89.32 6.6,89.57 U5.B7 21.47,89.57 26.54,84.51 53.85,84.51 55.14,83.21 55.14,81.27 U1.32
I2C1_SCL: length 56.7
  Top Layer w0.254: U1.42 49.5,77.01 v1(49.78,77.01)
  Bottom Layer w0.254: H6.3 90.55,88.7 82.17,80.31 57.66,80.31 53.59,76.25 50.55,76.25 v1(49.78,77.01)
I2C1_SDA: length 59.4
  Top Layer w0.254: v1(49.15,76.38) 49.15,76.66 U1.43
  Bottom Layer w0.254: v1(49.15,76.38) 49.78,75.74 53.85,75.74 57.91,79.81 83.19,79.81 93.09,89.71 H6.4
OSC32_IN: length 10.1
  Top Layer w0.254: C1.2 39.83,75.62 39.83,75.62 41.91,75.62 44.45,73.08 45.53,73.08 U1.3
OSC32_OUT: length 9.5
  Top Layer w0.254: C2.2 X1.1 39.84,73.08 43.81,73.08 44.2,72.69 45.86,72.69 U1.4
OSC_IN: length 16.6
  Top Layer w0.254: X2.1 36.2,69.42 C6.2 43.38,69.47 47.01,73.1 47.01,73.14
OSC_OUT: length 18.8
  Top Layer w0.254: X2.2 36.19,64.54 C7.1 39.09,64.51 U1.6
PA0: length 41.8
  Top Layer w0.254: U1.10 48.04,70.64 48.04,65.9 41.88,59.74 v1(25.07,59.74)
  Bottom Layer w0.254: v1(25.07,59.74) SW1.1
PA1: length 23.8
  Top Layer w0.254: v1(44.12,59.75) 48.4,64.02 48.4,70.29 U1.11
  Bottom Layer w0.254: v1(44.12,59.75) 36.72,52.34
PA2: length 21.5
  Top Layer w0.254: v1(50.86,57.24) 48.77,59.34 48.77,69.95 U1.12
  Bottom Layer w0.254: v1(50.86,57.24) SW7.1
PA3: length 37.8
  Top Layer w0.254: U1.13 52.2,70.08 52.2,64.06 54.99,61.27 71.75,61.27 v1(74.81,58.2)
  Bottom Layer w0.254: v1(74.81,58.2) SW10.1
PA4: length 63.4
  Top Layer w0.254: v1(52.96,66.47) 52.96,70.02 U1.14
  Bottom Layer w0.254: v1(52.96,66.47) 48.26,61.77 48.26,45.64 43.56,40.94 25.32,40.94 SW2.1
PA5: length 45.8
  Top Layer w0.254: v1(53.85,66.47) 53.85,69.84 U1.15
  Bottom Layer w0.254: 36.72,33.29 49.28,45.85 49.28,61.9 v1(53.85,66.47)
PA6: length 43.7
  Top Layer w0.254: v1(54.74,66.47) 54.74,69.66 52.67,71.73
  Bottom Layer w0.254: v1(54.74,66.47) 49.91,61.65 49.91,39.14 SW8.1
PA7: length 67.8
  Top Layer w0.254: U1.17 55.5,69.6 55.5,64.95 57.46,62.99 78.03,62.99 84.33,56.69 v1(84.33,42.8)
  Bottom Layer w0.254: v1(84.33,42.8) SW11.1
PB0: length 107.1
  Top Layer w0.254: v1(56.26,66.47) 56.26,69.55 U1.18
  Bottom Layer w0.254: SW3.1 27.86,24.44 64.13,24.44 68.96,29.26 68.96,53.77 v1(56.26,66.47)
PB1: length 89.4
  Top Layer w0.254: U1.19 57.15,69.37 v1(57.15,66.47)
  Bottom Layer w0.254: v1(57.15,66.47) 69.6,54.03 69.6,29.01 60.07,19.48 41.96,19.48 36.72,14.24
PB3: length 11.7
  Top Layer w0.254: U1.39 48.01,80.63 v1(48.01,82.09)
  Bottom Layer w0.254: v1(48.01,82.09) 48.01,87.16 v1(47.08,88.08) 47.08,90.75 C24.2
PB4: length 16.5
  Top Layer w0.254: 48.42,79.5 46.74,81.19 v1(46.74,82.09)
  Bottom Layer w0.254: C25.2 39.72,90.82 v1(39.72,88.08) 41.76,86.03 44.32,86.03 46.74,83.62 v1(46.74,82.09)
PB5: length 22.3
  Top Layer w0.254: v1(38.23,82.09) 45.13,82.09 U1.41
  Bottom Layer w0.254: v1(38.23,82.09) 32.24,88.08 v1(32.22,88.08) 32.22,90.8 C26.2
PB10: length 71.8
  Top Layer w0.254: U1.21 54.45,73.49 v1(55.75,72.19)
  Bottom Layer w0.254: v1(55.75,72.19) 70.23,57.71 70.23,28.7 SW9.1
PB11: length 68
  Top Layer w0.254: U1.22 55.31,73.33 55.5,73.33 v1(56.64,72.19)
  Bottom Layer w0.254: v1(56.64,72.19) 70.87,57.96 70.87,18.19 SW12.1
PC13: length 24.6
  Top Layer w0.254: U1.2 45.33,73.58 44.45,73.58 40.39,77.65 26.18,77.65 R5.2 24.14,75.64
RESET: length 21.2
  Top Layer w0.254: U1.7 47.75,72.43 v1(50.29,74.98) ; v1(61.51,78.16) 64.12,78.16 U2.3 64.15,75.83 C23.2
  Bottom Layer w0.254: v1(61.51,78.16) 57.02,78.16 53.85,74.98 v1(50.29,74.98)
SWCLK: length 41
  Top Layer w0.254: H1.3 72.11,98.37 66.19,98.37 64.49,96.67 64.49,92.61 v1(57.4,85.52) ; U1.37 52.96,77.09 v1(52.96,77.01)
  Bottom Layer w0.254: v1(57.4,85.52) 57.4,80.82 53.59,77.01 v1(52.96,77.01)
SWDIO: length 30.9
  Top Layer w0.254: v1(54.1,82.73) 54.1,81.65 U1.34 ; H1.2 69.98,97.97 66.42,97.97 64.9,96.44 64.9,91.75 57.53,84.38 v1(55.75,84.38)
  Bottom Layer w0.254: v1(55.75,84.38) v1(54.1,82.73)
USART1_RX: length 25.3
  Top Layer w0.254: H2.3 71.63,91.18 69.91,89.46 64.04,89.46 U1.31
USART1_TX: length 26.5
  Top Layer w0.254: H2.2 69.98,88.95 64.23,88.95 U1.30
$1N2502: length 2.3
  Top Layer w0.254: R5.1 24.15,71.92 LED2.2
$1N8138: length 2.5
  Top Layer w0.254: H3.2 59.14,95.98 R2.2
$1N8141: length 2.5
  Top Layer w0.254: H4.2 59.19,90.61 R3.1
$1N12765: length 2.2
  Top Layer w0.254: R1.1 16.24,74.1 LED1.2
$1N28341: length 3
  Top Layer w0.254: R6.1 10.17,90.83 9.42,90.07 U5.A5
$1N28394: length 2.7
  Top Layer w0.254: U5.B5 R7.1

## Copper pours and planes (outline as drawn; the poured copper is in the pictures)
GND on Top Layer: 0,100 100,100 100,0 0,0
GND on Bottom Layer: 0,100 100,100 100,0 0,0

Small or netless copper shapes (teardrops, artwork), in the pictures only: 181 on Top Layer, 88 on Bottom Layer

## Text on the board
Top Silkscreen Layer: POWER | PC13 | 0 | 1 | RST | 3V3 | DIO | RX | CLK | TX | GND | SCL | SDA | 2 | 3 | 小键盘V4.0
